# Altium schematic sheet L2.SchDoc
size A4
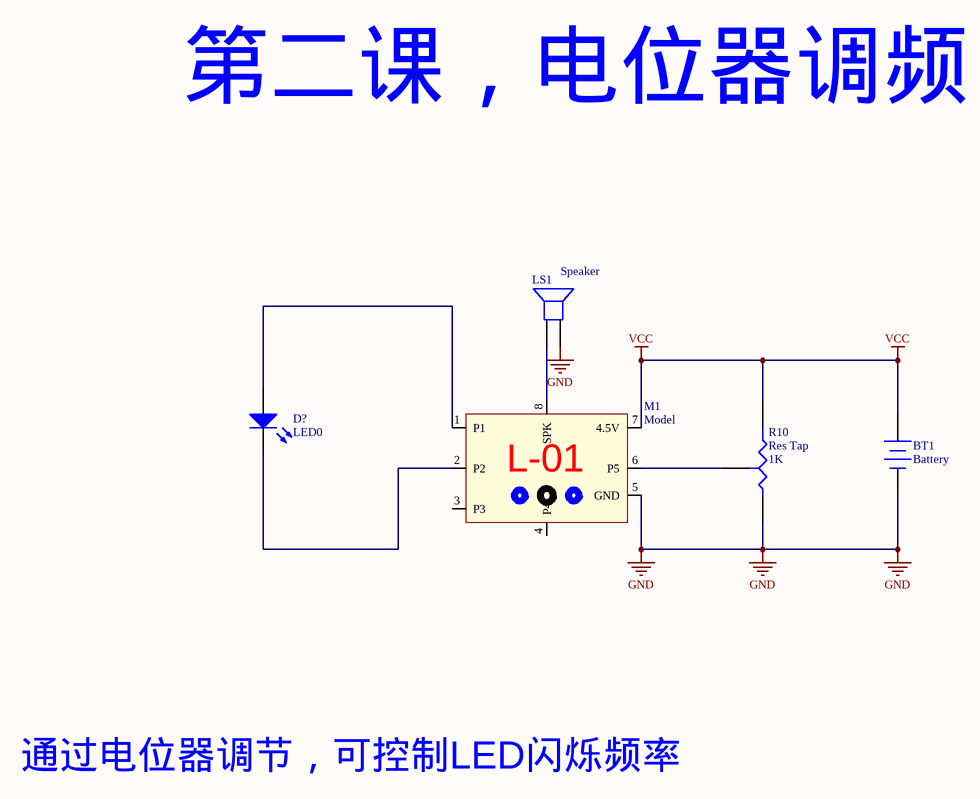
[diagram p0: L2.SchDoc]

## Parts
BT1  Battery  [BAT-2]
D?  LED0  [LED-0]
LS1  Speaker  [PIN2]
M1  Model
R10  Res Tap  value 1K  [VR3]

## Nets
GND: BT1.2(-) LS1.2 M1.5(GND) R10.1(A)
VCC: BT1.1(+) M1.7(4.5V) R10.2(B)
NetD?_1: D?.1(A) M1.1(P1)
NetD?_2: D?.2(K) M1.2(P2)
NetLS1_1: LS1.1 M1.8(SPK)
NetM1_6: M1.6(P5) R10.3(TAP)

Not connected (* = marked no-connect by the designer): M1 3(P3) 4(P4)

## Notes on the sheet
- Labels drawn without touching a wire or pin: L-01, 第二课，电位器调频, 通过电位器调节，可控制LED闪烁频率

## Library data of the parts
BT1 = Battery: Multicell Battery; Published: 24-Mar-1999; LatestRevisionDate: 17-Jul-2002; LatestRevisionNote: Re-released for DXP Platform.; PackageReference: BAT-2; Publisher: Altium Limited; PackageDescription: Battery; 2 Leads
D? = LED0: Typical INFRARED GaAs LED; Published: 8-Jun-2000; LatestRevisionDate: 08-Jul-2005; LatestRevisionNote: Mech Layer 1 removed.; PackageReference: LED-0; Publisher: Altium Limited; PackageDescription: LED; 2 Leads
LS1 = Speaker: Loudspeaker; Published: 24-Mar-1999; LatestRevisionDate: 17-Jul-2002; LatestRevisionNote: Re-released for DXP Platform.; PackageReference: PIN2; Publisher: Altium Limited
M1 = M?: 积木模块
R10 = Res Tap: Tapped Resistor; Sim Note: Enter the Resistance value and the set point into parameter fields.; Set Position: 0.5; Published: 24-Mar-1999; LatestRevisionDate: 17-Jul-2002; LatestRevisionNote: Re-released for DXP Platform.; PackageReference: VR3; Publisher: Altium Limited; PackageDescription: Variable Resistor, Thru-Hole; 3 Leads